# Altium schematic sheet Sheet2.SchDoc
size A
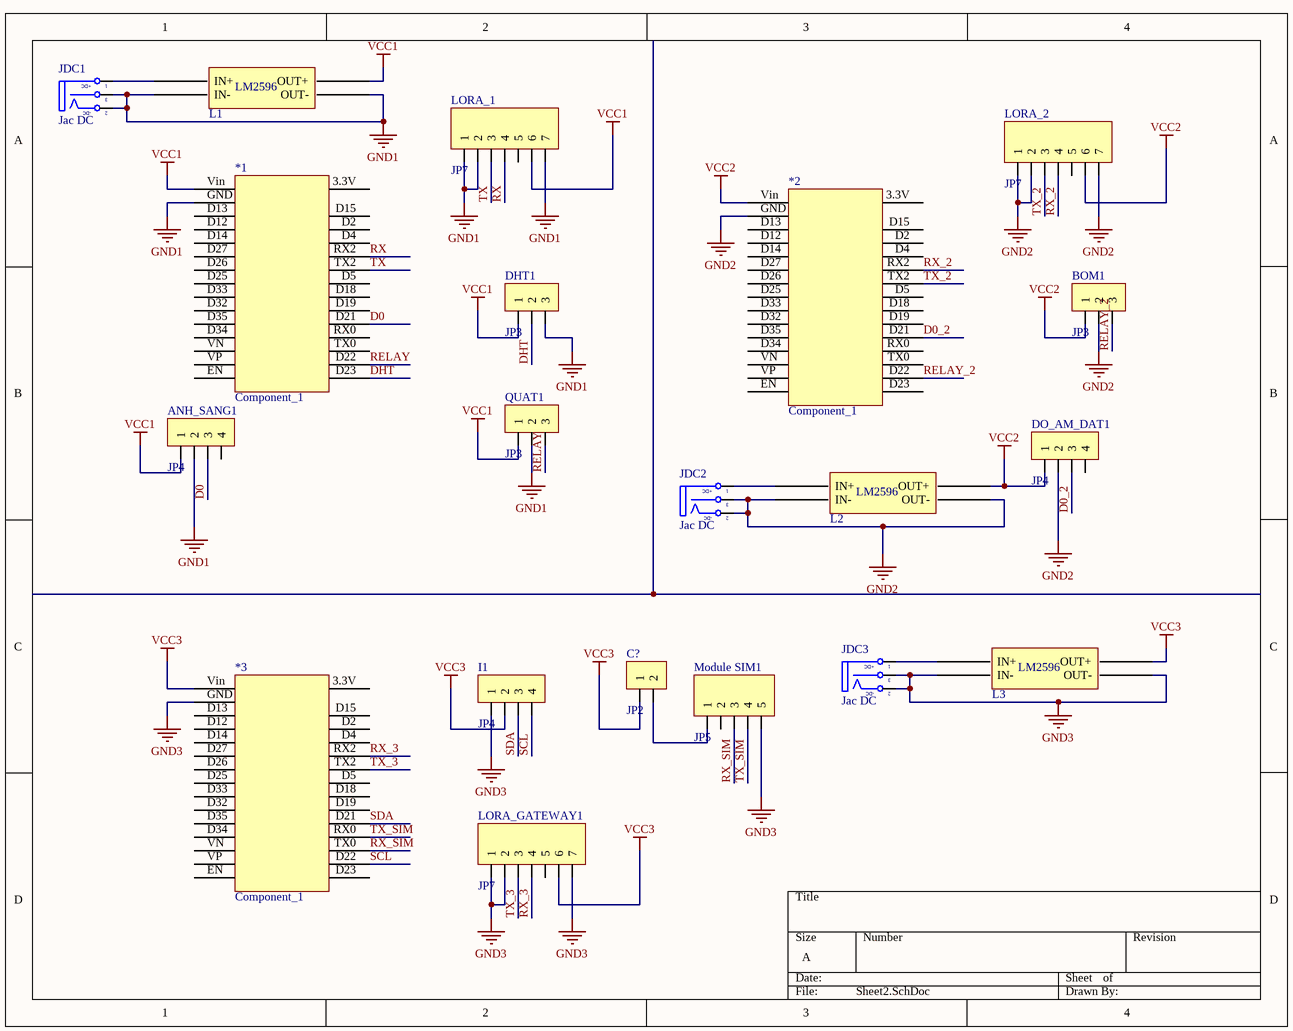
[diagram p0: Sheet2.SchDoc]

## Parts
*1  Component_1  [PCBComponent_1]
*2  Component_1  [PCBComponent_1]
*3  Component_1  [PCBComponent_1]
ANH_SANG1  JP4  [JP4-C1T]
BOM1  JP3  [JP3-C1T]
C?  JP2  [JP2-C1T]
DHT1  JP3  [JP3-C1T]
DO_AM_DAT1  JP4  [JP4-C1T]
I1  JP4  [JP4-C1T]
JDC1  Jac DC  [DC0]
JDC2  Jac DC  [DC0]
JDC3  Jac DC  [DC0]
L1  BUCK_LM2596  [BUCK_LM2596]  (value not drawn)
L2  BUCK_LM2596  [BUCK_LM2596]  (value not drawn)
L3  BUCK_LM2596  [BUCK_LM2596]  (value not drawn)
LORA_1  JP7  [JP7-C1C]
LORA_2  JP7  [JP7-C1C]
LORA_GATEWAY1  JP7  [JP7-C1C]
Module_SIM1  JP5  [JP5-C1T]
QUAT1  JP3  [JP3-C1T]

## Nets
GND1: ANH_SANG1.2 DHT1.3 JDC1.2(TN) JDC1.3(S) L1.2(IN-) L1.3(OUT-) LORA_1.1 LORA_1.2 LORA_1.7 QUAT1.2
GND2: BOM1.2 DO_AM_DAT1.2 JDC2.2(TN) JDC2.3(S) L2.2(IN-) L2.3(OUT-) LORA_2.1 LORA_2.2 LORA_2.7
GND3: I1.1 JDC3.2(TN) JDC3.3(S) L3.2(IN-) L3.3(OUT-) LORA_GATEWAY1.1 LORA_GATEWAY1.2 LORA_GATEWAY1.7 Module_SIM1.5
VCC1: ANH_SANG1.1 DHT1.1 L1.4(OUT+) LORA_1.6 QUAT1.1
VCC2: BOM1.1 DO_AM_DAT1.1 L2.4(OUT+) LORA_2.6
VCC3: C?.1 I1.2 L3.4(OUT+) LORA_GATEWAY1.6
D0: ANH_SANG1.3
D0_2: DO_AM_DAT1.3
DHT: DHT1.2
RELAY: QUAT1.3
RELAY_2: BOM1.3
RX: LORA_1.4
RX_2: LORA_2.4
RX_3: LORA_GATEWAY1.4
RX_SIM: Module_SIM1.3
SCL: I1.4
SDA: I1.3
TX: LORA_1.3
TX_2: LORA_2.3
TX_3: LORA_GATEWAY1.3
TX_SIM: Module_SIM1.4
NetC?_2: C?.2 Module_SIM1.1
NetJDC1_1: JDC1.1(T) L1.1(IN+)
NetJDC2_1: JDC2.1(T) L2.1(IN+)
NetJDC3_1: JDC3.1(T) L3.1(IN+)

Not connected (* = marked no-connect by the designer): *1 3.3V(0) D2(3) D4(4) D5(7) D12(26) D13(27) D14(25) D15(2) D18(8) D19(9) D21(10) D22(13) D23(14) D25(22) D26(23) D27(24) D32(20) D33(21) D34(18) D35(19) EN(16) GND(1) RX0(11) RX2(5) TX0(12) TX2(6) Vin(29) VN(17) VP(15); *2 3.3V(0) D2(3) D4(4) D5(7) D12(26) D13(27) D14(25) D15(2) D18(8) D19(9) D21(10) D22(13) D23(14) D25(22) D26(23) D27(24) D32(20) D33(21) D34(18) D35(19) EN(16) GND(1) RX0(11) RX2(5) TX0(12) TX2(6) Vin(29) VN(17) VP(15); *3 3.3V(0) D2(3) D4(4) D5(7) D12(26) D13(27) D14(25) D15(2) D18(8) D19(9) D21(10) D22(13) D23(14) D25(22) D26(23) D27(24) D32(20) D33(21) D34(18) D35(19) EN(16) GND(1) RX0(11) RX2(5) TX0(12) TX2(6) Vin(29) VN(17) VP(15); ANH_SANG1 4; DO_AM_DAT1 4; LORA_1 5; LORA_2 5; LORA_GATEWAY1 5; Module_SIM1 2

## Notes on the sheet
- (in symbol BUCK_LM2596) LM2596
- (in symbol DCIN) +DC; -DC

## Library data of the parts
ANH_SANG1 DO_AM_DAT1 I1 = JP4: WR-PHD 2.54 mm Angled Socket Header; Manufacturer: W¨¹rth Elektronik eiSos GmbH; partNo: 613004143121; ComponentLink1 Description: Manufacturer; ComponentLink2 Description: Datasheet; NoPins: 04; Created Date: 29 March 2013; ComponentLink1URL: http://www.we-online.com; ComponentLink2URL: http://katalog.we-online.de/em/datasheet/6130xx143121.pdf; Created by: Karrer Zheng
BOM1 DHT1 QUAT1 = JP3: WR-PHD 2.54 mm Angled Socket Header; Manufacturer: W¨¹rth Elektronik eiSos GmbH; partNo: 613003143121; ComponentLink1 Description: Manufacturer; ComponentLink2 Description: Datasheet; NoPins: 03; Created Date: 29 March 2013; ComponentLink1URL: http://www.we-online.com; ComponentLink2URL: http://katalog.we-online.de/em/datasheet/6130xx143121.pdf; Created by: Karrer Zheng
C? = JP2: WR-PHD 2.54 mm Angled Socket Header; Manufacturer: W¨¹rth Elektronik eiSos GmbH; partNo: 613002143121; ComponentLink1 Description: Manufacturer; ComponentLink2 Description: Datasheet; NoPins: 02; Created Date: 29 March 2013; ComponentLink1URL: http://www.we-online.com; ComponentLink2URL: http://katalog.we-online.de/em/datasheet/6130xx143121.pdf; Created by: Karrer Zheng
JDC1-JDC3 = DCIN: Jac DC input; Value: Jac DC
LORA_1 LORA_2 LORA_GATEWAY1 = JP7: WR-PHD 2.54 mm Angled Socket Header; Manufacturer: W¨¹rth Elektronik eiSos GmbH; partNo: 613007143121; ComponentLink1 Description: Manufacturer; ComponentLink2 Description: Datasheet; NoPins: 07; Created Date: 29 March 2013; ComponentLink1URL: http://www.we-online.com; ComponentLink2URL: http://katalog.we-online.de/em/datasheet/6130xx143121.pdf; Created by: Karrer Zheng
Module_SIM1 = JP5: WR-PHD 2.54 mm Angled Socket Header; Manufacturer: W¨¹rth Elektronik eiSos GmbH; partNo: 613005143121; ComponentLink1 Description: Manufacturer; ComponentLink2 Description: Datasheet; NoPins: 05; Created Date: 29 March 2013; ComponentLink1URL: http://www.we-online.com; ComponentLink2URL: http://katalog.we-online.de/em/datasheet/6130xx143121.pdf; Created by: Karrer Zheng